# Altium schematic sheet perechen_elementov.schdoc
size 209 x 297 mm
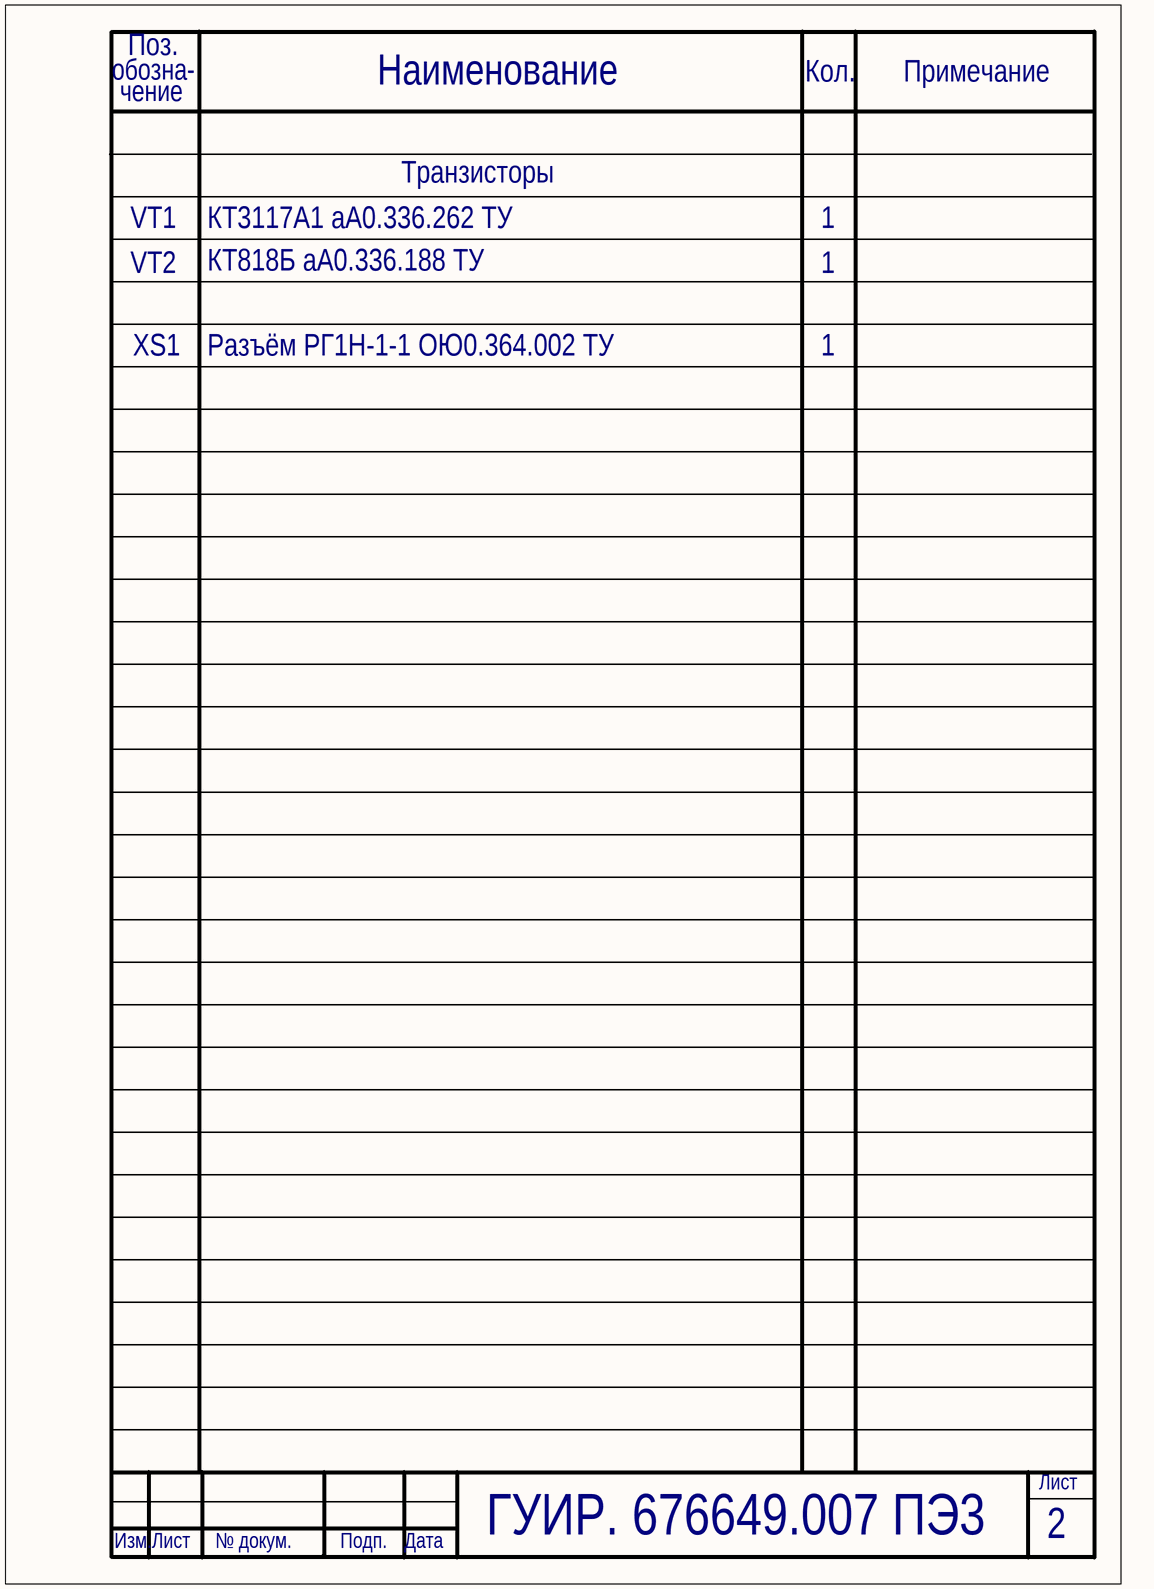
[diagram p0: perechen_elementov.schdoc]

## Notes on the sheet
- Поз.
- обозна-
- чение
- Наименование
- Кол.
- Примечание
- Транзисторы
- VT1
- КТ3117А1 аА0.336.262 ТУ
- 1
- VT2
- КТ818Б аА0.336.188 ТУ
- XS1
- Разъём РГ1Н-1-1 ОЮ0.364.002 ТУ
- ГУИР. 676649.007 ПЭ3
- Лист
- 2
- Изм.
- № докум.
- Подп.
- Дата